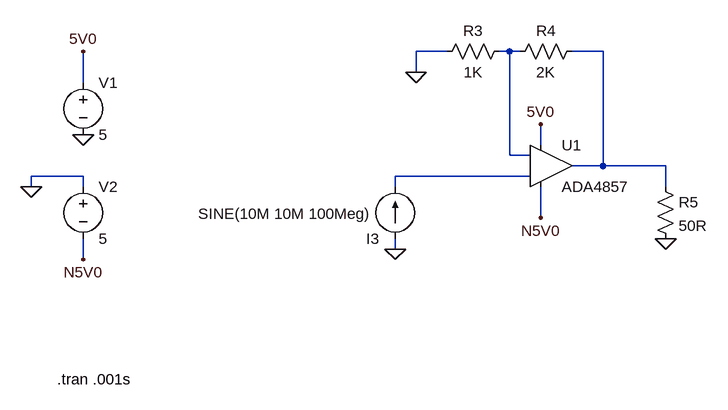
[diagram p0: schematic analog_noninvopamp.asc]
analog_noninvopamp.asc, the LTspice schematic file:
Version 4
SHEET 1 880 680
WIRE 368 -96 320 -96
WIRE 464 -96 448 -96
WIRE 480 -96 464 -96
WIRE 608 -96 560 -96
WIRE 320 -64 320 -96
WIRE -192 -48 -192 -96
WIRE 512 48 512 16
WIRE 464 64 464 -96
WIRE 496 64 464 64
WIRE 608 80 608 -96
WIRE 608 80 560 80
WIRE 704 80 608 80
WIRE -192 96 -272 96
WIRE 496 96 288 96
WIRE -272 112 -272 96
WIRE -192 112 -192 96
WIRE 288 112 288 96
WIRE 704 112 704 80
WIRE 512 160 512 112
WIRE 288 208 288 192
WIRE -192 224 -192 192
FLAG -192 32 0
FLAG -272 112 0
FLAG -192 224 N5V0
FLAG -192 -96 5V0
FLAG 512 16 5V0
FLAG 512 160 N5V0
FLAG 320 -64 0
FLAG 704 192 0
FLAG 288 208 0
SYMBOL OpAmps\\ADA4857 528 80 R0
SYMATTR InstName U1
SYMBOL voltage -192 -64 R0
WINDOW 123 0 0 Left 0
WINDOW 39 0 0 Left 0
SYMATTR InstName V1
SYMATTR Value 5
SYMBOL voltage -192 96 R0
WINDOW 123 0 0 Left 0
WINDOW 39 0 0 Left 0
SYMATTR InstName V2
SYMATTR Value 5
SYMBOL res 464 -112 R90
WINDOW 0 0 56 VBottom 2
WINDOW 3 32 56 VTop 2
SYMATTR InstName R3
SYMATTR Value 1K
SYMBOL res 576 -112 R90
WINDOW 0 0 56 VBottom 2
WINDOW 3 32 56 VTop 2
SYMATTR InstName R4
SYMATTR Value 2K
SYMBOL res 688 96 R0
SYMATTR InstName R5
SYMATTR Value 50R
SYMBOL current 288 192 R180
WINDOW 3 35 38 Left 2
WINDOW 123 0 0 Left 0
WINDOW 39 0 0 Left 0
SYMATTR Value SINE(10M 10M 100Meg)
SYMATTR InstName I3
TEXT -232 408 Left 2 !.tran .001s

The netlist it stands for:
* analog_noninvopamp.asc
XU1 N003 N001 5V0 N5V0 N002 NC_01 ADA4857
V1 5V0 0 5
V2 0 N5V0 5
R3 N001 0 1K
R4 N002 N001 2K
R5 N002 0 50R
I3 0 N003 SINE(10M 10M 100Meg)
.tran .001s
.lib ADI1.lib
.backanno
.end